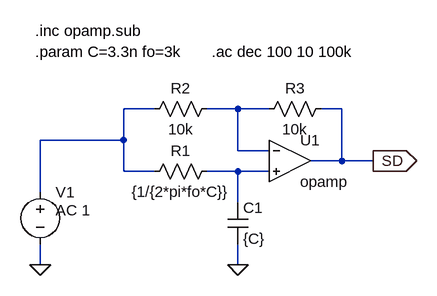
[diagram p0: schematic dephaseur.asc]
dephaseur.asc, the LTspice schematic file:
Version 4
SHEET 1 880 680
WIRE -16 112 -64 112
WIRE 112 112 64 112
WIRE 160 112 112 112
WIRE 272 112 240 112
WIRE -64 160 -64 112
WIRE -64 160 -192 160
WIRE 112 176 112 112
WIRE 160 176 112 176
WIRE 272 192 272 112
WIRE 272 192 224 192
WIRE 320 192 272 192
WIRE -64 208 -64 160
WIRE -16 208 -64 208
WIRE 112 208 64 208
WIRE 160 208 112 208
WIRE -192 240 -192 160
WIRE 112 256 112 208
WIRE -192 352 -192 320
WIRE 112 352 112 320
FLAG 112 352 0
FLAG -192 352 0
FLAG 320 192 SD
IOPIN 320 192 Out
SYMBOL Opamps\\opamp 192 128 R0
SYMATTR InstName U1
SYMATTR SpiceLine2 GBW=100Meg
SYMBOL cap 96 256 R0
SYMATTR InstName C1
SYMATTR Value {C}
SYMBOL res 80 192 R90
WINDOW 0 0 56 VBottom 2
WINDOW 3 32 56 VTop 2
SYMATTR InstName R1
SYMATTR Value {1/{2*pi*fo*C}}
SYMBOL res 80 96 R90
WINDOW 0 0 56 VBottom 2
WINDOW 3 32 56 VTop 2
SYMATTR InstName R2
SYMATTR Value 10k
SYMBOL res 256 96 R90
WINDOW 0 0 56 VBottom 2
WINDOW 3 32 56 VTop 2
SYMATTR InstName R3
SYMATTR Value 10k
SYMBOL voltage -192 224 R0
WINDOW 123 24 44 Left 2
WINDOW 39 0 0 Left 2
SYMATTR Value2 AC 1
SYMATTR InstName V1
SYMATTR Value ""
TEXT -200 24 Left 2 !.param C=3.3n fo=3k
TEXT -200 -8 Left 2 !.inc opamp.sub
TEXT 72 24 Left 2 !.ac dec 100 10 100k

The netlist it stands for:
* dephaseur.asc
XU1 N002 N003 SD opamp Aol=100K GBW=100Meg  ; pins invin noninvin out
C1 N003 0 {C}
R1 N003 N001 {1/{2*pi*fo*C}}
R2 N002 N001 10k
R3 SD N002 10k
V1 N001 0 AC 1
.param C=3.3n fo=3k
.inc opamp.sub
.ac dec 100 10 100k
.backanno
.end